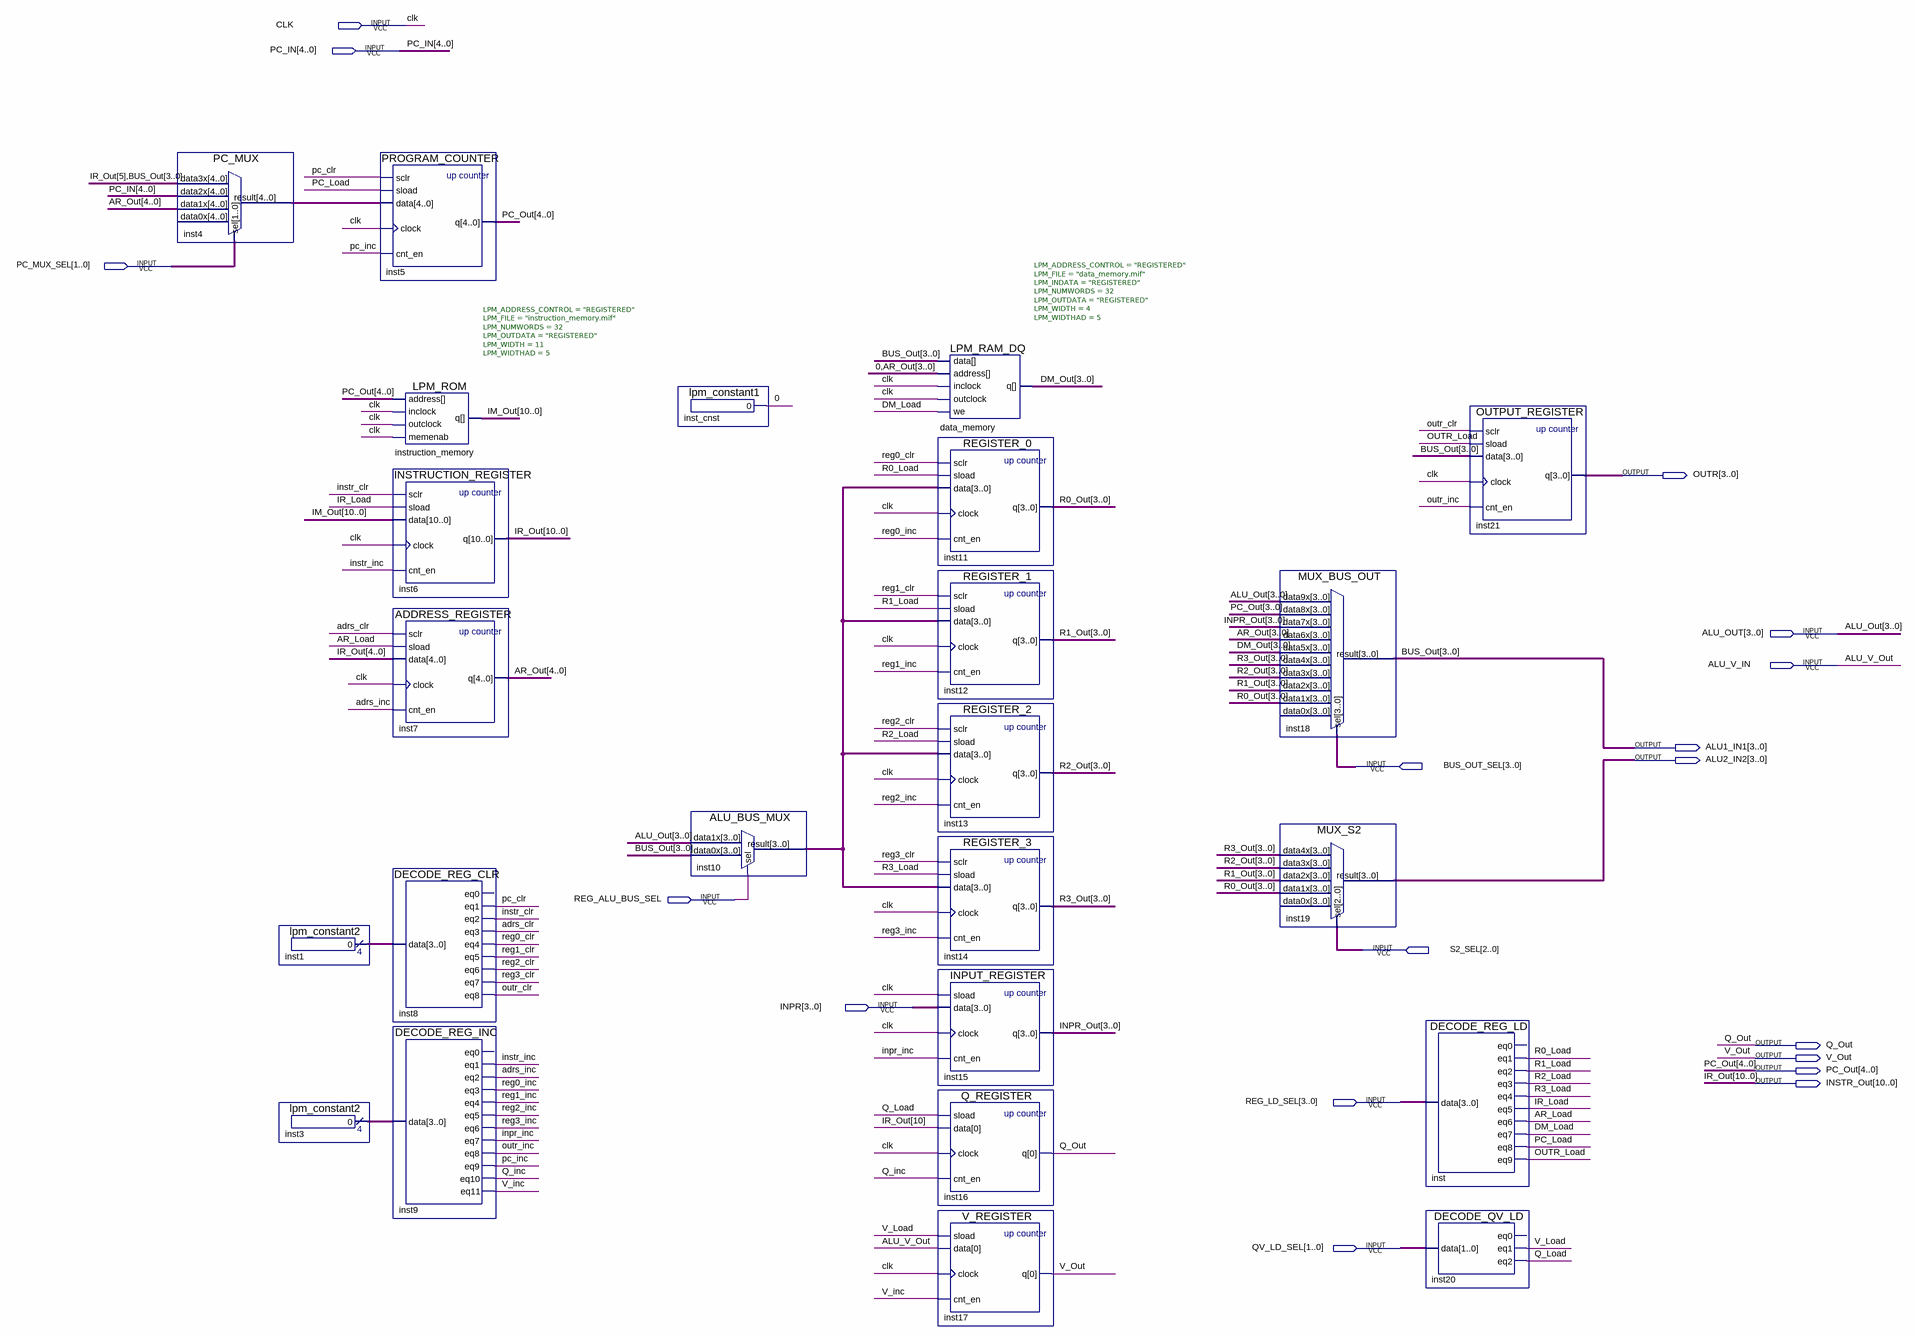
[diagram p0: schematic sheet]
// Quartus schematic Common_Bus_System.bdf as structural Verilog: 24 symbols, 18 pins
module Common_Bus_System (
  input  CLK,
  input  [4:0] PC_IN,
  input  [1:0] PC_MUX_SEL,
  input  [3:0] ALU_OUT,
  input  ALU_V_IN,
  input  [3:0] BUS_OUT_SEL,
  input  REG_ALU_BUS_SEL,
  input  [2:0] S2_SEL,
  input  [3:0] INPR,
  input  [3:0] REG_LD_SEL,
  input  [1:0] QV_LD_SEL,
  output [3:0] OUTR,
  output [3:0] ALU1_IN1,
  output [3:0] ALU2_IN2,
  output Q_Out,
  output V_Out,
  output [4:0] PC_Out,
  output [10:0] INSTR_Out
);

  wire \0 , adrs_clr, adrs_inc, AR_Load, DM_Load, inpr_inc, instr_clr, instr_inc, IR_Load, outr_clr,
       outr_inc, OUTR_Load, pc_clr, pc_inc, PC_Load, Q_inc, Q_Load, R0_Load, R1_Load, R2_Load, R3_Load,
       reg0_clr, reg0_inc, reg1_clr, reg1_inc, reg2_clr, reg2_inc, reg3_clr, reg3_inc, V_inc, V_Load;
  wire [3:0] DM_Out, INPR_Out, inst1_result, inst3_result, inst10_result, R0_Out, R1_Out, R2_Out, R3_Out;
  wire [4:0] AR_Out, inst4_result;
  wire [10:0] IM_Out;

  PC_MUX inst4 (
    .data3x({INSTR_Out[5], ALU1_IN1}), .data2x(PC_IN), .data1x(AR_Out), .sel(PC_MUX_SEL),
    .result(inst4_result));  // open: data0x
  lpm_constant2 inst1 (.result(inst1_result));
  lpm_constant2 inst3 (.result(inst3_result));
  PROGRAM_COUNTER inst5 (.sclr(pc_clr), .sload(PC_Load), .data(inst4_result), .clock(CLK), .cnt_en(pc_inc), .q(PC_Out));
  LPM_ROM #(.LPM_ADDRESS_CONTROL("REGISTERED"), .LPM_FILE("instruction_memory.mif"), .LPM_NUMWORDS(32), .LPM_OUTDATA("REGISTERED"), .LPM_WIDTH(11), .LPM_WIDTHAD(5)) instruction_memory (
    .address(PC_Out), .inclock(CLK), .outclock(CLK), .memenab(CLK), .q(IM_Out));
  INSTRUCTION_REGISTER inst6 (
    .sclr(instr_clr), .sload(IR_Load), .data(IM_Out), .clock(CLK), .cnt_en(instr_inc), .q(INSTR_Out));
  ADDRESS_REGISTER inst7 (
    .sclr(adrs_clr), .sload(AR_Load), .data(INSTR_Out[4:0]), .clock(CLK), .cnt_en(adrs_inc), .q(AR_Out));
  DECODE_REG_CLR inst8 (
    .data(inst1_result), .eq1(pc_clr), .eq2(instr_clr), .eq3(adrs_clr), .eq4(reg0_clr), .eq5(reg1_clr),
    .eq6(reg2_clr), .eq7(reg3_clr), .eq8(outr_clr));  // open: eq0
  DECODE_REG_INC inst9 (
    .data(inst3_result), .eq1(instr_inc), .eq2(adrs_inc), .eq3(reg0_inc), .eq4(reg1_inc), .eq5(reg2_inc),
    .eq6(reg3_inc), .eq7(inpr_inc), .eq8(outr_inc), .eq9(pc_inc), .eq10(Q_inc), .eq11(V_inc));  // open: eq0
  lpm_constant1 inst_cnst (.result(\0 ));
  ALU_BUS_MUX inst10 (.data1x(ALU_OUT), .data0x(ALU1_IN1), .sel(REG_ALU_BUS_SEL), .result(inst10_result));
  LPM_RAM_DQ #(.LPM_ADDRESS_CONTROL("REGISTERED"), .LPM_FILE("data_memory.mif"), .LPM_INDATA("REGISTERED"), .LPM_NUMWORDS(32), .LPM_OUTDATA("REGISTERED"), .LPM_WIDTH(4), .LPM_WIDTHAD(5)) data_memory (
    .inclock(CLK), .data(ALU1_IN1), .address({\0 , AR_Out[3:0]}), .we(DM_Load), .outclock(CLK), .q(DM_Out));
  REGISTER_0 inst11 (
    .sclr(reg0_clr), .sload(R0_Load), .data(inst10_result), .clock(CLK), .cnt_en(reg0_inc), .q(R0_Out));
  REGISTER_1 inst12 (
    .sclr(reg1_clr), .sload(R1_Load), .data(inst10_result), .clock(CLK), .cnt_en(reg1_inc), .q(R1_Out));
  REGISTER_2 inst13 (
    .sclr(reg2_clr), .sload(R2_Load), .data(inst10_result), .clock(CLK), .cnt_en(reg2_inc), .q(R2_Out));
  REGISTER_3 inst14 (
    .sclr(reg3_clr), .sload(R3_Load), .data(inst10_result), .clock(CLK), .cnt_en(reg3_inc), .q(R3_Out));
  INPUT_REGISTER inst15 (.sload(CLK), .data(INPR), .clock(CLK), .cnt_en(inpr_inc), .q(INPR_Out));
  Q_REGISTER inst16 (.sload(Q_Load), .data(INSTR_Out[10]), .clock(CLK), .cnt_en(Q_inc), .q(Q_Out));
  V_REGISTER inst17 (.sload(V_Load), .data(ALU_V_IN), .clock(CLK), .cnt_en(V_inc), .q(V_Out));
  MUX_BUS_OUT inst18 (
    .data9x(ALU_OUT), .data8x(PC_Out[3:0]), .data7x(INPR_Out), .data6x(AR_Out[3:0]), .data5x(DM_Out),
    .data4x(R3_Out), .data3x(R2_Out), .data2x(R1_Out), .data1x(R0_Out), .sel(BUS_OUT_SEL), .result(ALU1_IN1));  // open: data0x
  MUX_S2 inst19 (
    .data4x(R3_Out), .data3x(R2_Out), .data2x(R1_Out), .data1x(R0_Out), .sel(S2_SEL), .result(ALU2_IN2));  // open: data0x
  DECODE_REG_LD inst (
    .data(REG_LD_SEL), .eq1(R0_Load), .eq2(R1_Load), .eq3(R2_Load), .eq4(R3_Load), .eq5(IR_Load),
    .eq6(AR_Load), .eq7(DM_Load), .eq8(PC_Load), .eq9(OUTR_Load));  // open: eq0
  DECODE_QV_LD inst20 (.data(QV_LD_SEL), .eq1(V_Load), .eq2(Q_Load));  // open: eq0
  OUTPUT_REGISTER inst21 (
    .sclr(outr_clr), .sload(OUTR_Load), .data(ALU1_IN1), .clock(CLK), .cnt_en(outr_inc), .q(OUTR));

  // Other names for the same wires on the sheet: ALU_V_Out = ALU_V_IN; BUS_Out[3:0] = ALU1_IN1;
  //   IR_Out[10:0] = INSTR_Out
endmodule
